# Altium schematic sheet H-mostik.SchDoc
size A
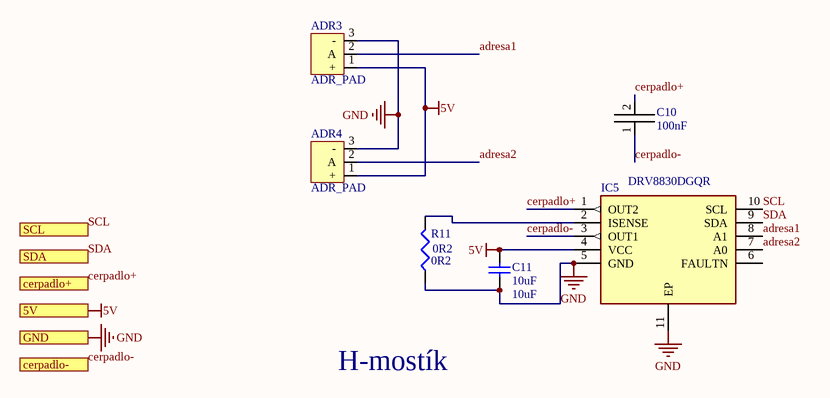
[diagram p0: H-mostik.SchDoc]

## Parts
ADR3  ADR_PAD  [SOLDER_PAD]
ADR4  ADR_PAD  [SOLDER_PAD]
C10  100nF  [Capacitor]
C11  10uF  [C2512]
IC5  DRV8830DGQR  [SOP50P490X110-11N]
R11  0R2  [J1-0603]

## Ports
5V, cerpadlo+, cerpadlo-, GND, SCL, SDA

## Nets
5V: ADR3.1(+) ADR4.1(+) C11.2 IC5.4(VCC) ; port 5V
GND: ADR3.3(-) ADR4.3(-) C11.1 IC5.5(GND) IC5.11(EP) R11.1 ; port GND
adresa1: ADR3.2(A) IC5.8(A1)
adresa2: ADR4.2(A) IC5.7(A0)
cerpadlo+: C10.2 IC5.1(OUT2) ; port cerpadlo+
cerpadlo-: C10.1 IC5.3(OUT1) ; port cerpadlo-
SCL: IC5.10(SCL) ; port SCL
SDA: IC5.9(SDA) ; port SDA
NetIC5_2: IC5.2(ISENSE) R11.2

Not connected (* = marked no-connect by the designer): IC5 6(FAULTN)

## Notes on the sheet
- H-mostík

## Library data of the parts
ADR3 ADR4 = ADR_PAD: ADR PAD 3 PIN
C10 = Cap
C11 = Cap Semi: Capacitor (Semiconductor SIM Model); Published: 8-Jun-2000; LatestRevisionDate: 29-May-2009; LatestRevisionNote: IPC-7351 Footprint Added.; PackageReference: C1206; Publisher: Altium Limited; PackageDescription: Chip Capacitor; Value: 10uF
IC5 = DRV8830DGQR: Integrated Circuit; Manufacturer_Name: Texas Instruments; Datasheet Link: http://www.ti.com/lit/ds/symlink/drv8830.pdf; Height: 1.1mm; Manufacturer_Part_Number: DRV8830DGQR; Mouser Part Number: 595-DRV8830DGQR; Mouser Price/Stock: https://www.mouser.com/Search/Refine.aspx?Keyword=595-DRV8830DGQR; RS Part Number: 1626149; RS Price/Stock: http://uk.rs-online.com/web/p/products/1626149
R11 = Res3: Resistor; Published: 8-Jun-2000; LatestRevisionDate: 29-May-2009; LatestRevisionNote: IPC-7351 Footprint Added.; PackageReference: J1-0603; Publisher: Altium Limited; PackageDescription: Chip Resistor; Value: 0R2